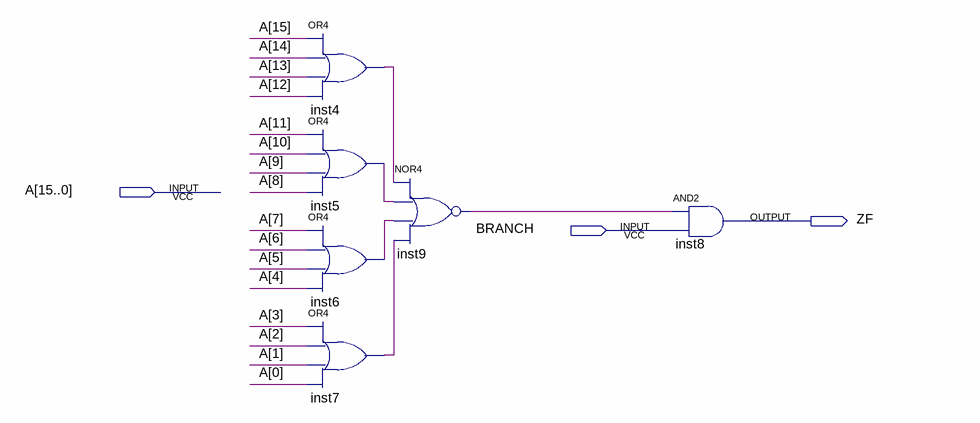
[diagram p0: schematic sheet]
// Quartus schematic ZF.bdf as structural Verilog: 6 symbols, 3 pins
module ZF (
  input  [15:0] A,
  input  BRANCH,
  output ZF
);

  wire inst4_out, inst5_out, inst6_out, inst7_out, inst9_out;

  or inst4 (inst4_out, A[15], A[14], A[13], A[12]);
  or inst5 (inst5_out, A[11], A[10], A[9], A[8]);
  or inst6 (inst6_out, A[7], A[6], A[5], A[4]);
  or inst7 (inst7_out, A[3], A[2], A[1], A[0]);
  nor inst9 (inst9_out, inst4_out, inst5_out, inst6_out, inst7_out);
  and inst8 (ZF, inst9_out, BRANCH);
endmodule
